# EAGLE schematic Expanssion Bay (EAGLE 9.5.1)
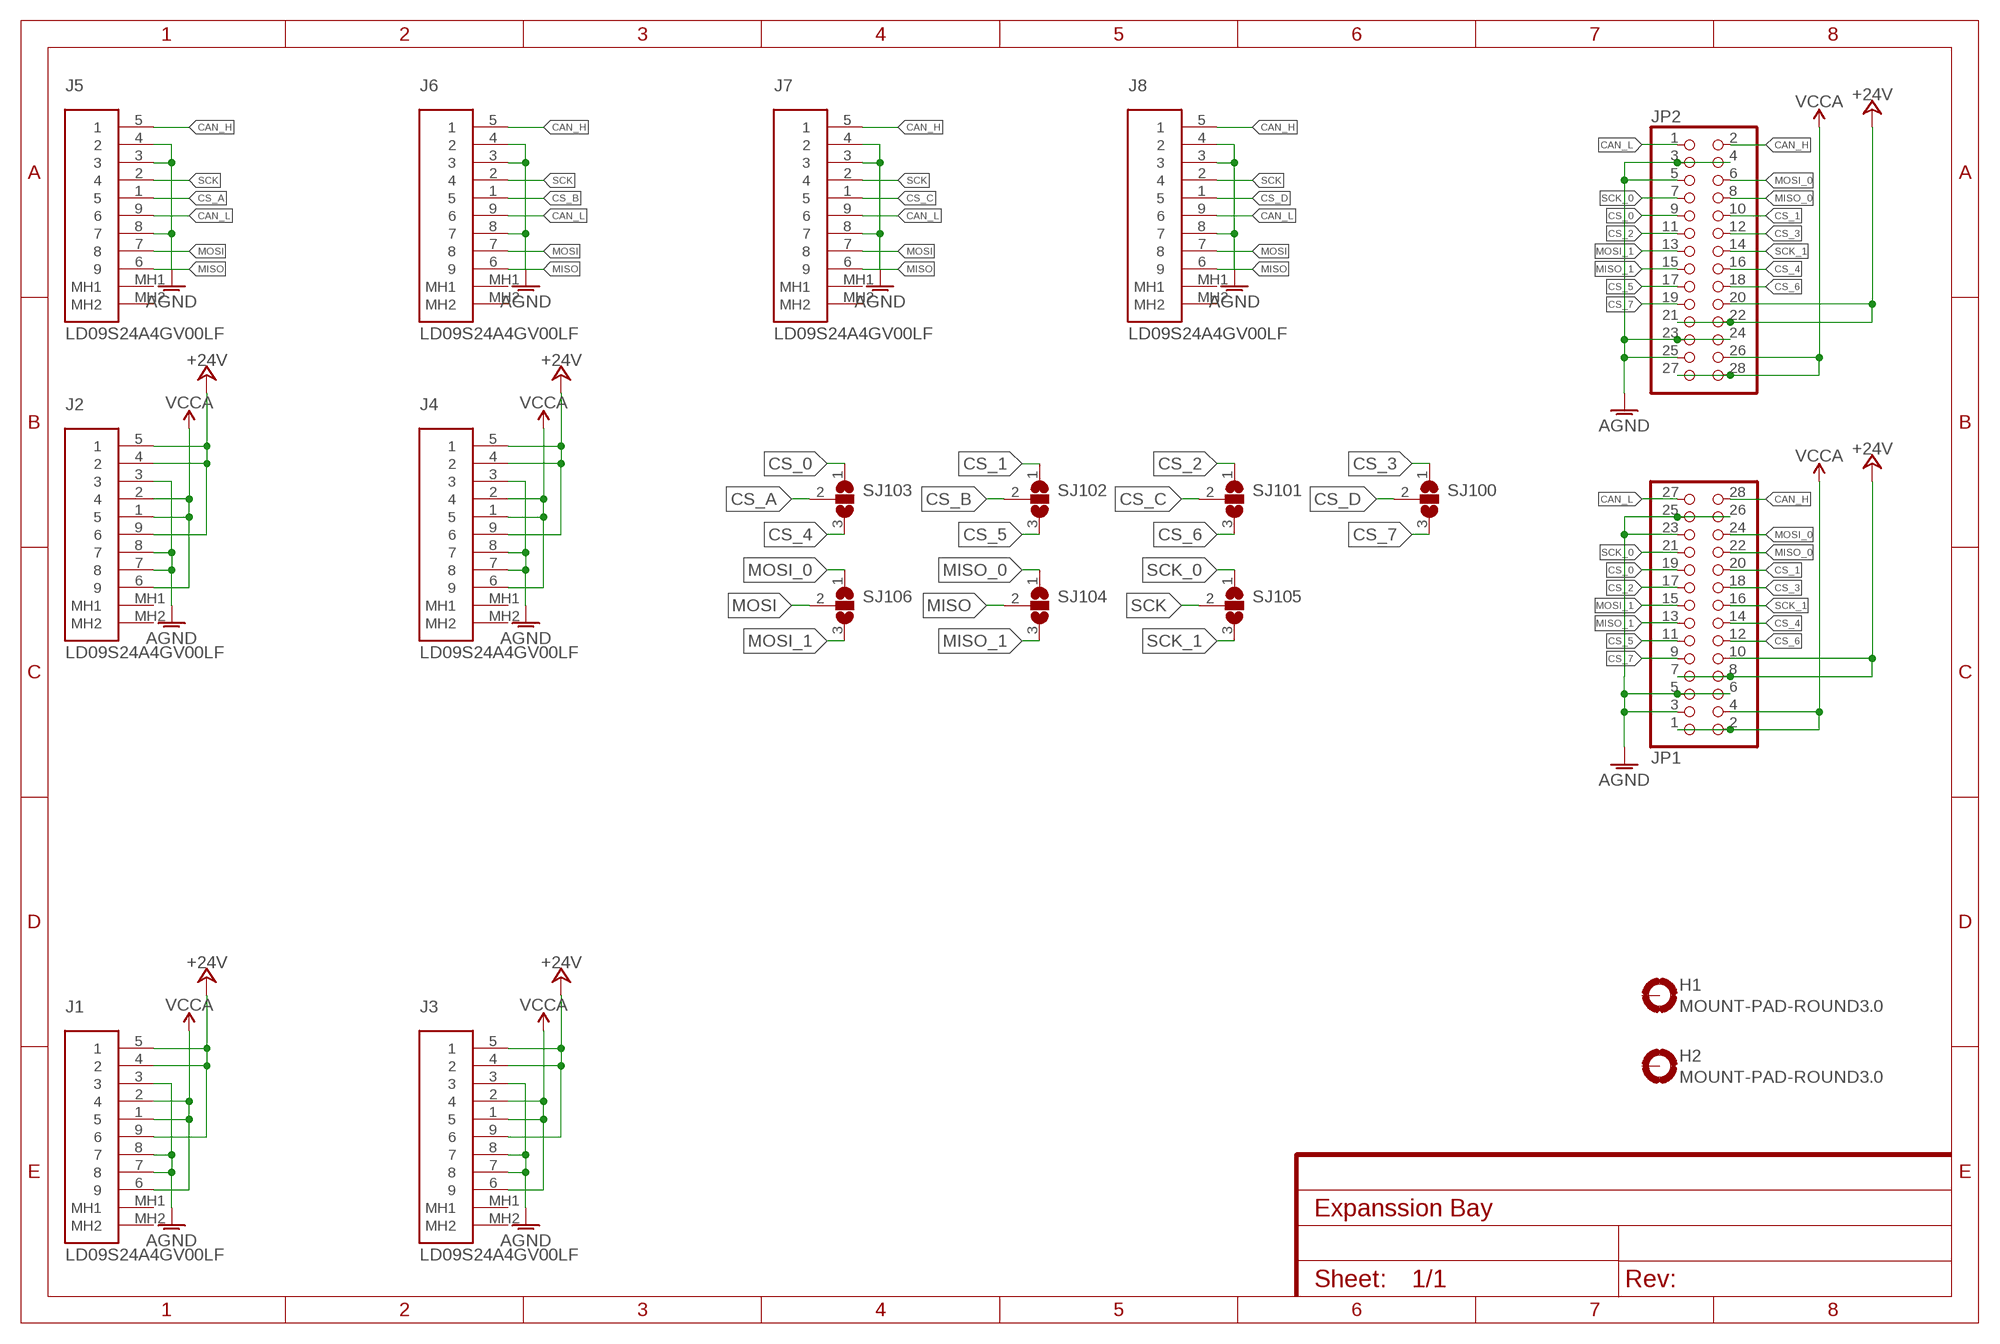
[diagram p0: schematic, sheet 1]

## Parts
H1  MOUNT-PAD-ROUND3.0  [3,0-PAD]
H2  MOUNT-PAD-ROUND3.0  [3,0-PAD]
J1  LD09S24A4GV00LF  [LD09S24A4GV00LF]
J2  LD09S24A4GV00LF  [LD09S24A4GV00LF]
J3  LD09S24A4GV00LF  [LD09S24A4GV00LF]
J4  LD09S24A4GV00LF  [LD09S24A4GV00LF]
J5  LD09S24A4GV00LF  [LD09S24A4GV00LF]
J6  LD09S24A4GV00LF  [LD09S24A4GV00LF]
J7  LD09S24A4GV00LF  [LD09S24A4GV00LF]
J8  LD09S24A4GV00LF  [LD09S24A4GV00LF]
JP1  PINHD-2X14/90  [2X14/90]
JP2  PINHD-2X14/90  [2X14/90]
SJ100  SJ2W  [SJ_2]
SJ101  SJ2W  [SJ_2]
SJ102  SJ2W  [SJ_2]
SJ103  SJ2W  [SJ_2]
SJ104  SJ2W  [SJ_2]
SJ105  SJ2W  [SJ_2]
SJ106  SJ2W  [SJ_2]

## Nets
+24V: J1.4 J1.5 J1.9 J2.4 J2.5 J2.9 J3.4 J3.5 J3.9 J4.4 J4.5 J4.9 JP1.7 JP1.8 JP1.10 JP2.20 JP2.21 JP2.22
AGND: J1.3 J1.7 J1.8 J2.3 J2.7 J2.8 J3.3 J3.7 J3.8 J4.3 J4.7 J4.8 J5.3 J5.4 J5.8 J6.3 J6.4 J6.8 J7.3 J7.4 J7.8 J8.3 J8.4 J8.8 JP1.3 JP1.5 JP1.6 JP1.23 JP1.25 JP1.26 JP2.3 JP2.4 JP2.5 JP2.23 JP2.24 JP2.25
CAN_H: J5.5 J6.5 J7.5 J8.5 JP1.28 JP2.2
CAN_L: J5.9 J6.9 J7.9 J8.9 JP1.27 JP2.1
CS_0: JP1.19 JP2.9 SJ103.1
CS_1: JP1.20 JP2.10 SJ102.1
CS_2: JP1.17 JP2.11 SJ101.1
CS_3: JP1.18 JP2.12 SJ100.1
CS_4: JP1.14 JP2.16 SJ103.3
CS_5: JP1.11 JP2.17 SJ102.3
CS_6: JP1.12 JP2.18 SJ101.3
CS_7: JP1.9 JP2.19 SJ100.3
CS_A: J5.1 SJ103.2
CS_B: J6.1 SJ102.2
CS_C: J7.1 SJ101.2
CS_D: J8.1 SJ100.2
MISO: J5.6 J6.6 J7.6 J8.6 SJ104.2
MISO_0: JP1.22 JP2.8 SJ104.1
MISO_1: JP1.13 JP2.15 SJ104.3
MOSI: J5.7 J6.7 J7.7 J8.7 SJ106.2
MOSI_0: JP1.24 JP2.6 SJ106.1
MOSI_1: JP1.15 JP2.13 SJ106.3
SCK: J5.2 J6.2 J7.2 J8.2 SJ105.2
SCK_0: JP1.21 JP2.7 SJ105.1
SCK_1: JP1.16 JP2.14 SJ105.3
VCCA: J1.1 J1.2 J1.6 J2.1 J2.2 J2.6 J3.1 J3.2 J3.6 J4.1 J4.2 J4.6 JP1.1 JP1.2 JP1.4 JP2.26 JP2.27 JP2.28
Unconnected: H1.B3,0(MOUNT) H2.B3,0(MOUNT) J1.MH1 J1.MH2 J2.MH1 J2.MH2 J3.MH1 J3.MH2 J4.MH1 J4.MH2 J5.MH1 J5.MH2 J6.MH1 J6.MH2 J7.MH1 J7.MH2 J8.MH1 J8.MH2

## Library data of the parts
H1 H2 = holes:MOUNT-PAD-ROUND: MOUNTING PAD, round
J1-J8 = D-Sub Connectors:LD09S24A4GV00LF: CONN D-SUB RCPT 9POS VERT SOLDER Manufacturer's datasheet <https://www.amphenol-icc.com/media/wysiwyg/files/drawing/10130912.pdf>; CREATED_BY: PCBLayout.com; DIGIKEY_PART_NUMBER: 609-5190-ND; MANUFACTURER: Amphenol ICC (FCI); MPN: LD09S24A4GV00LF
JP1 JP2 = pinhead:PINHD-2X14: PIN HEADER
SJ100-SJ106 = jumper:SJ2W: SMD solder JUMPER